# EAGLE schematic CanSat Circuit Diagram (EAGLE 7.2.0)
DESIGNER: Ashwin Ahuja; VERSION: v01
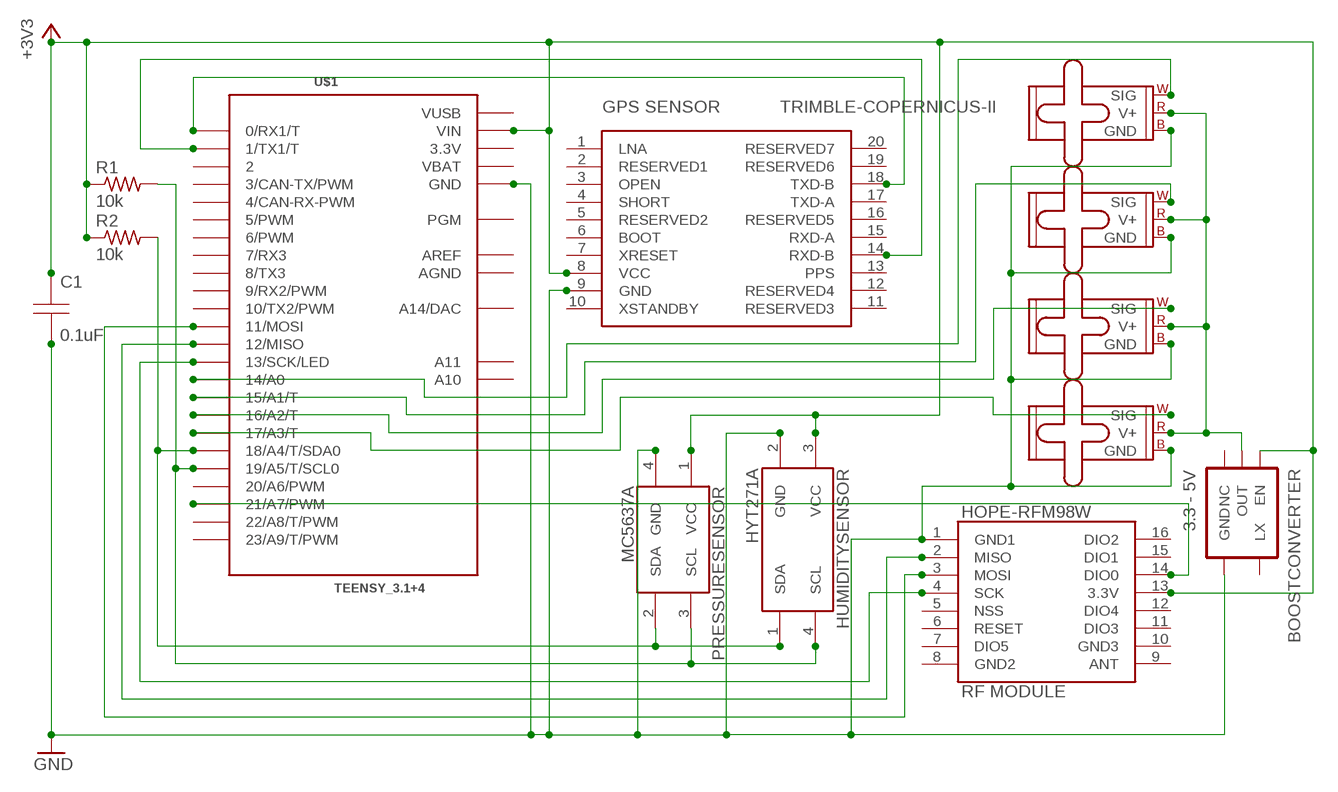
[diagram p0: schematic, sheet 1]

## Parts
BOOSTCONVERTER  3.3 - 5V  V_REG_NCP1400SOT23-5  [SOT23-5]
C1  0.1uF  CAP  [C0805]
HOPE-RFM98W  RF MODULE  HOPEA  [HOPE]
HUMIDITYSENSOR  HYT271A  [HYT271]
M1  SMALL_SERVO  [1X03]
M2  SMALL_SERVO  [1X03]
M3  SMALL_SERVO  [1X03]
M4  SMALL_SERVO  [1X03]
PRESSURESENSOR  MC5637A  [MS5637]
R1  10k  FLIPFLOP-RES  [0805-THM]
R2  10k  FLIPFLOP-RES  [0805-THM]
TRIMBLE-COPERNICUS-II  GPS SENSOR  COPERNICUS-DIPPTH  [COPERNICUS-DIP]
U$1  TEENSY_3.1+4  [TEENSY_3.1+4]

## Nets
+3V3: BOOSTCONVERTER.1(EN) C1.1(A) HOPE-RFM98W.13(3.3V) HUMIDITYSENSOR.3(VCC) PRESSURESENSOR.1(VCC) R1.1 R2.1 TRIMBLE-COPERNICUS-II.8(VCC) U$1.VIN
GND: BOOSTCONVERTER.4(GND) C1.2(B) HOPE-RFM98W.1(GND1) HUMIDITYSENSOR.2(GND) M1.3(GND) M2.3(GND) M3.3(GND) M4.3(GND) PRESSURESENSOR.4(GND) TRIMBLE-COPERNICUS-II.9(GND) U$1.GND U$1.GND1(GND)
N$1: TRIMBLE-COPERNICUS-II.18(TXD-B) U$1.0(0/RX1/T)
N$2: TRIMBLE-COPERNICUS-II.14(RXD-B) U$1.1(1/TX1/T)
N$3: HOPE-RFM98W.2(MISO) U$1.12(12/MISO)
N$4: HOPE-RFM98W.3(MOSI) U$1.11(11/MOSI)
N$5: HOPE-RFM98W.4(SCK) U$1.13(13/SCK/LED)
N$6: BOOSTCONVERTER.2(OUT) M1.2(V+) M2.2(V+) M3.2(V+) M4.2(V+)
N$7: HUMIDITYSENSOR.1(SDA) PRESSURESENSOR.2(SDA) R2.2 U$1.18/A4(18/A4/T/SDA0)
N$8: HUMIDITYSENSOR.4(SCL) PRESSURESENSOR.3(SCL) R1.2 U$1.19/A5(19/A5/T/SCL0)
N$9: M3.1(SIG) U$1.17/A3(17/A3/T)
N$10: M4.1(SIG) U$1.16/A2(16/A2/T)
N$11: M2.1(SIG) U$1.15/A1(15/A1/T)
N$12: M1.1(SIG) U$1.14/A0
N$13: HOPE-RFM98W.14(DIO0) U$1.21/A7(21/A7/PWM)
Unconnected: BOOSTCONVERTER.3(NC) BOOSTCONVERTER.5(LX) HOPE-RFM98W.5(NSS) HOPE-RFM98W.6(RESET) HOPE-RFM98W.7(DIO5) HOPE-RFM98W.8(GND2) HOPE-RFM98W.9(ANT) HOPE-RFM98W.10(GND3) HOPE-RFM98W.11(DIO3) HOPE-RFM98W.12(DIO4) HOPE-RFM98W.15(DIO1) HOPE-RFM98W.16(DIO2) TRIMBLE-COPERNICUS-II.1(LNA) TRIMBLE-COPERNICUS-II.2(RESERVED1) TRIMBLE-COPERNICUS-II.3(OPEN) TRIMBLE-COPERNICUS-II.4(SHORT) TRIMBLE-COPERNICUS-II.5(RESERVED2) TRIMBLE-COPERNICUS-II.6(BOOT) TRIMBLE-COPERNICUS-II.7(XRESET) TRIMBLE-COPERNICUS-II.10(XSTANDBY) TRIMBLE-COPERNICUS-II.11(RESERVED3) TRIMBLE-COPERNICUS-II.12(RESERVED4) TRIMBLE-COPERNICUS-II.13(PPS) TRIMBLE-COPERNICUS-II.15(RXD-A) TRIMBLE-COPERNICUS-II.16(RESERVED5) TRIMBLE-COPERNICUS-II.17(TXD-A) TRIMBLE-COPERNICUS-II.19(RESERVED6) TRIMBLE-COPERNICUS-II.20(RESERVED7) U$1.2 U$1.3(3/CAN-TX/PWM) U$1.4(4/CAN-RX-PWM) U$1.5(5/PWM) U$1.6(6/PWM) U$1.7(7/RX3) U$1.8(8/TX3) U$1.9(9/RX2/PWM) U$1.10(10/TX2/PWM) U$1.20/A6(20/A6/PWM) U$1.22/A8(22/A8/T/PWM) U$1.23/A9(23/A9/T/PWM) U$1.A10 U$1.A11 U$1.A14(A14/DAC) U$1.PGM

## Power pins joined to a net without a drawn wire
3.3V: U$1.3.3V U$1.3.3V1(3.3V)
AGND: U$1.AGND
AREF: U$1.AREF
VBAT: U$1.VBAT
VUSB: U$1.VUSB

## Library data of the parts
BOOSTCONVERTER = SparkFun-PowerIC:V_REG_NCP1400: Switching step-up voltage regulator NCP1400 switiching regulator takes single cell AA and outputs 100mA at 3.3V or 5V with minimal number of external components.
C1 = sym:CAP: Capacitor
HOPE-RFM98W = Hope:HOPE
HUMIDITYSENSOR = HYT271:HYT271
M1-M4 = SparkFun-Electromechanical:SMALL_SERVO: Small servo motor This is the small servo used in the SIK. SKU: ROB-09065
PRESSURESENSOR = cansat:MC5637
R1 R2 = adafruit:FLIPFLOP-RES: Flip Flop resistor An 0805 resistor inside a standard 1/4W 5% resistor. Makes for easy mods
TRIMBLE-COPERNICUS-II = SparkFun-RF:COPERNICUS-DIP: Copernicus II dip module, SKU GPS-10923
U$1 = Teensy_3_Series_Board_v1.0:TEENSY_3.1+4: Footprint for Teensy 3.1 board using all through-holes, i.e. the entire perimeter plus the 4 through-holes inboard (A10,A11,AREF, VUSB)